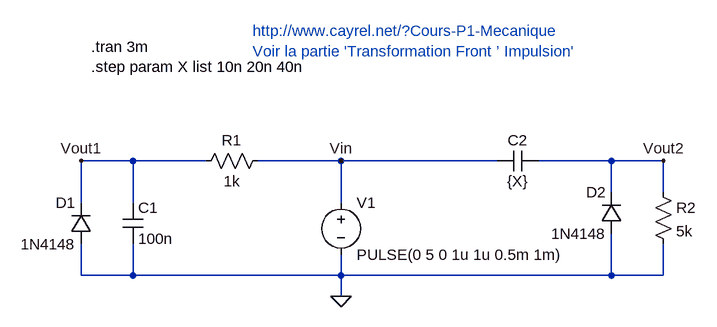
[diagram p0: schematic square_to_pulse.asc]
square_to_pulse.asc, the LTspice schematic file:
Version 4
SHEET 1 880 680
WIRE -32 96 -112 96
WIRE 80 96 -32 96
WIRE 288 96 160 96
WIRE 528 96 288 96
WIRE 704 96 592 96
WIRE 784 96 704 96
WIRE 704 144 704 96
WIRE 784 144 784 96
WIRE -112 160 -112 96
WIRE -32 160 -32 96
WIRE 288 160 288 96
WIRE -112 272 -112 224
WIRE -32 272 -32 224
WIRE -32 272 -112 272
WIRE 288 272 288 240
WIRE 288 272 -32 272
WIRE 704 272 704 208
WIRE 704 272 288 272
WIRE 784 272 784 224
WIRE 784 272 704 272
WIRE 288 304 288 272
FLAG 288 304 0
FLAG -112 96 Vout1
FLAG 288 96 Vin
FLAG 784 96 Vout2
SYMBOL voltage 288 144 R0
SYMATTR InstName V1
SYMATTR Value PULSE(0 5 0 1u 1u 0.5m 1m)
SYMBOL res 176 80 R90
WINDOW 0 0 56 VBottom 2
WINDOW 3 32 56 VTop 2
SYMATTR InstName R1
SYMATTR Value 1k
SYMBOL cap -48 160 R0
SYMATTR InstName C1
SYMATTR Value 100n
SYMBOL diode -96 224 R180
WINDOW 0 24 64 Left 2
WINDOW 3 24 0 Left 2
SYMATTR InstName D1
SYMATTR Value 1N4148
SYMBOL res 768 128 R0
SYMATTR InstName R2
SYMATTR Value 5k
SYMBOL diode 720 208 R180
WINDOW 0 24 64 Left 2
WINDOW 3 24 0 Left 2
SYMATTR InstName D2
SYMATTR Value 1N4148
SYMBOL cap 592 80 R90
WINDOW 0 0 32 VBottom 2
WINDOW 3 32 32 VTop 2
SYMATTR InstName C2
SYMATTR Value {X}
TEXT -96 -80 Left 2 !.tran 3m\n.step param X list 10n 20n 40n
TEXT 152 -104 Left 2 ;http://www.cayrel.net/?Cours-P1-Mecanique\nVoir la partie 'Transformation Front ’ Impulsion'

The netlist it stands for:
* square_to_pulse.asc
V1 Vin 0 PULSE(0 5 0 1u 1u 0.5m 1m)
R1 Vin Vout1 1k
C1 Vout1 0 100n
D1 0 Vout1 1N4148
R2 Vout2 0 5k
D2 0 Vout2 1N4148
C2 Vout2 Vin {X}
.model D D
.lib standard.dio
.tran 3m
.step param X list 10n 20n 40n
* http://www.cayrel.net/?Cours-P1-Mecanique
* Voir la partie 'Transformation Front ’ Impulsion'
.backanno
.end